# Altium project 20211127_mach duoi NCKH.PrjPcb
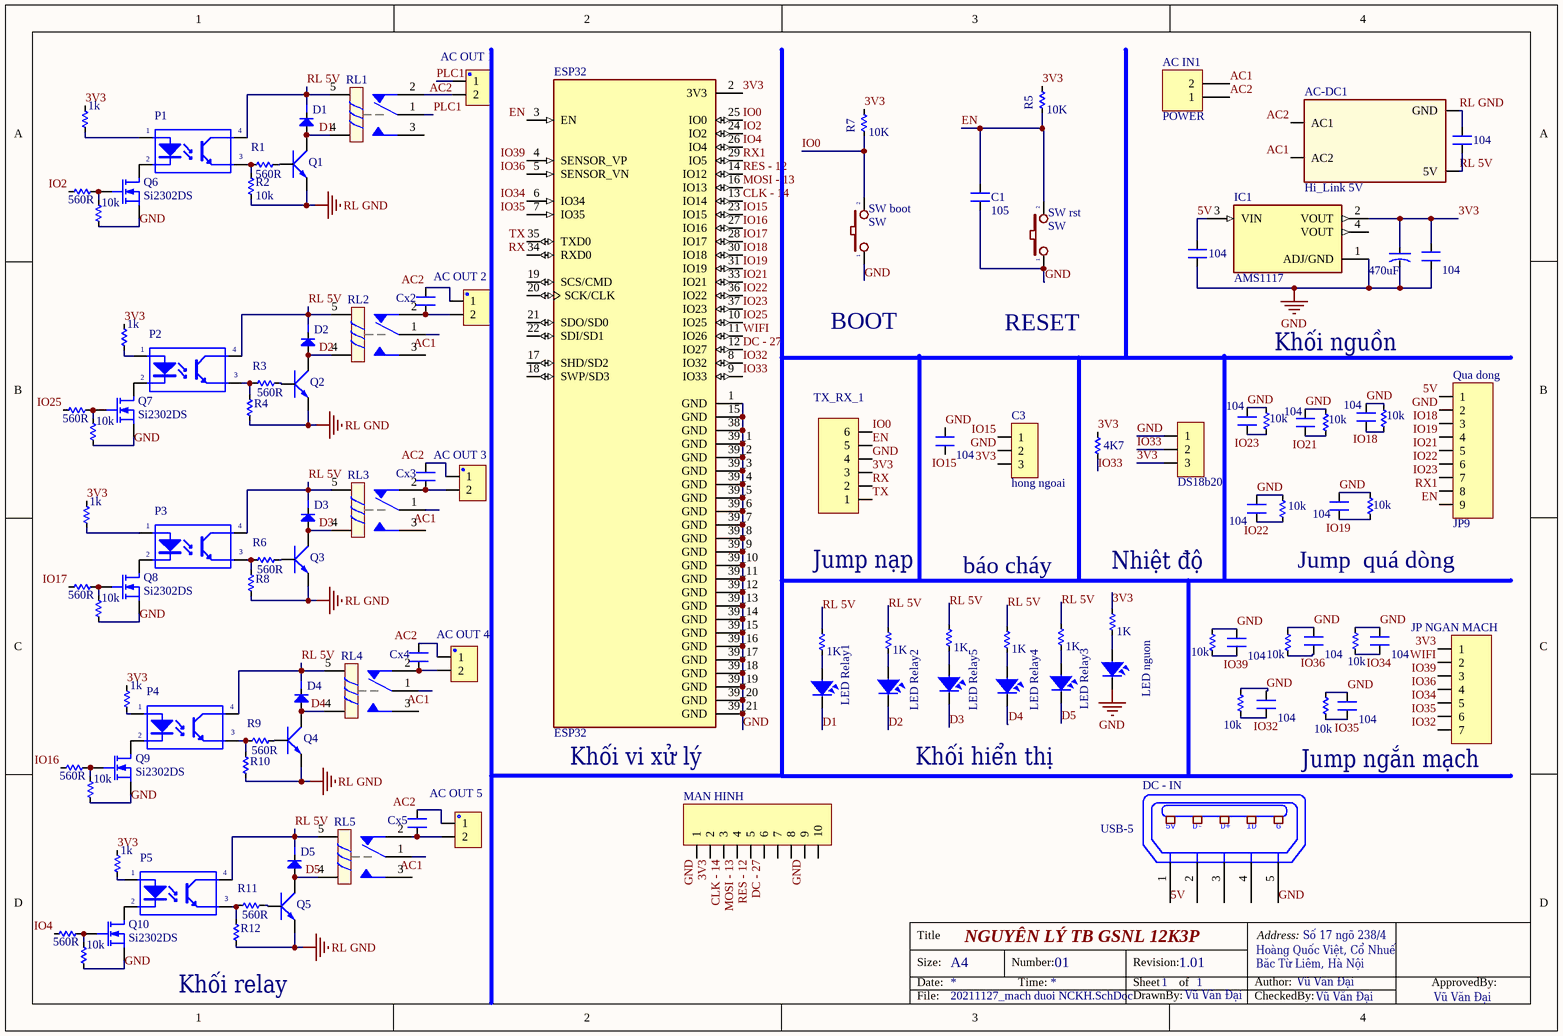
[diagram p0: 20211127_mach duoi NCKH.SchDoc]
1 sheet, 113 parts. Net scope: global (net labels, ports and power ports of the same name join across sheets).
Board files: 20211127_mach duoi NCKH.PcbDoc, in.PcbDoc

## Sheet 20211127_mach duoi NCKH.SchDoc: NGUYÊN LÝ TB GSNL 12K3P
size A4; ENG_APP_DATE: --/--/--; DSN_APP_DATE: --/--/--; CHK_APP_DATE: --/--/--; Date: T3; ApprovedBy: Vũ Văn Đại; CheckedBy: Vũ Văn Đại; Author: Vũ Văn Đại; DrawnBy: Vũ Văn Đại; Engineer: KS Vu Van Dại; Organization: IOTeamVN; Address1: Số 17 ngõ 238/4; Address2: Hoàng Quốc Việt, Cổ Nhuế; Address3: Băc Từ Liêm, Hà Nội; Address4: -; DocumentNumber: 01; Revision: 1.01; SheetNumber: 1; SheetTotal: 1; Time: 06:00

### Parts
1  1k  [RES-SMD-0805]
2  1k  [RES-SMD-0805]
3  1k  [RES-SMD-0805]
4  1K  [RES-SMD-0805]
5  10k  [RES-SMD-0805]
6  1k  [RES-SMD-0805]
7  1k  [RES-SMD-0805]
8  1K  [RES-SMD-0805]
9  1K  [RES-SMD-0805]
10  1K  [RES-SMD-0805]
11  1K  [RES-SMD-0805]
12  1K  [RES-SMD-0805]
13  10k  [RES-SMD-0805]
14  10k  [RES-SMD-0805]
15  10k  [RES-SMD-0805]
16  10k  [RES-SMD-0805]
17  560R  [RES-SMD-0805]
18  10k  [RES-SMD-0805]
19  560R  [RES-SMD-0805]
20  10k  [RES-SMD-0805]
21  560R  [RES-SMD-0805]
22  10k  [RES-SMD-0805]
23  560R  [RES-SMD-0805]
24  10k  [RES-SMD-0805]
25  560R  [RES-SMD-0805]
26  10k  [RES-SMD-0805]
27  10k  [RES-SMD-0805]
28  10k  [RES-SMD-0805]
29  10k  [RES-SMD-0805]
30  10k  [RES-SMD-0805]
31  10k  [RES-SMD-0805]
AC-DC1  Hi_Link 5V  [HI LINK 3.3V5W, 5V5W]
AC_IN1  POWER  [HED2]
AC_OUT_1  Header2  [con 2 p xanh la]  (value not drawn)
AC_OUT_2  Header2  [con 2 p xanh la]  (value not drawn)
AC_OUT_3  Header2  [con 2 p xanh la]  (value not drawn)
AC_OUT_4  Header2  [con 2 p xanh la]  (value not drawn)
AC_OUT_5  Header2  [con 2 p xanh la]  (value not drawn)
C1  105  [CN-SMD-0805]
C3  hong ngoai  [JP3-D1C]
CAP_1  470uF  [CA-ALU-6.3R]
cc1  104  [CN-SMD-0805]
cc2  104  [CN-SMD-0805]
cc3  104  [CN-SMD-0805]
cc4  104  [CN-SMD-0805]
cc5  104  [CN-SMD-0805]
cc6  104  [CN-SMD-0805]
cc7  104  [CN-SMD-0805]
cc8  104  [CN-SMD-0805]
cc9  104  [CN-SMD-0805]
cc10  104  [CN-SMD-0805]
cc11  104  [CN-SMD-0805]
cc12  104  [CN-SMD-0805]
cc13  104  [CN-SMD-0805]
cc14  104  [CN-SMD-0805]
Cx2  XXpF  [CN2-O]  (value not drawn)
Cx3  XXpF  [CN2-O]  (value not drawn)
Cx4  XXpF  [CN2-O]  (value not drawn)
Cx5  XXpF  [CN2-O]  (value not drawn)
D1  Diode  [DIO-1A]  (value not drawn)
D2  Diode  [DIO-1A]  (value not drawn)
D3  Diode  [DIO-1A]  (value not drawn)
D4  Diode  [DIO-1A]  (value not drawn)
D5  Diode  [DIO-1A]  (value not drawn)
DC_-_IN  USB-5  [USB-M1]
DS1  DS18b20  [JP3-D1C]
ESP32  ESP32  [ESP32]
IC1  AMS1117  [Ams1117]
JP_NGAN_MACH  JP7  [JP7-D1C]  (value not drawn)
LED_nguon  LED  [LED-0805-Blue]  (value not drawn)
LED_Relay1  LED  [LED-0805-Red]  (value not drawn)
LED_Relay2  LED  [LED-0805-Red]  (value not drawn)
LED_Relay3  LED  [LED-0805-Red]  (value not drawn)
LED_Relay4  LED  [LED-0805-Red]  (value not drawn)
LED_Relay5  LED  [LED-0805-Red]  (value not drawn)
MAN_HINH  JP10  [JP10-D1C]  (value not drawn)
P1  PC817  [DIP4]  (value not drawn)
P2  PC817  [DIP4]  (value not drawn)
P3  PC817  [DIP4]  (value not drawn)
P4  PC817  [DIP4]  (value not drawn)
P5  PC817  [DIP4]  (value not drawn)
Q1  C1815  [TO92-123 - 3]  (value not drawn)
Q2  C1815  [TO92-123 - 3]  (value not drawn)
Q3  C1815  [TO92-123 - 3]  (value not drawn)
Q4  C1815  [TO92-123 - 3]  (value not drawn)
Q5  C1815  [TO92-123 - 3]  (value not drawn)
Q6  Si2302DS  [SOT23-132]
Q7  Si2302DS  [SOT23-132]
Q8  Si2302DS  [SOT23-132]
Q9  Si2302DS  [SOT23-132]
Q10  Si2302DS  [SOT23-132]
Qua_dong  JP9  [JP9-D1C]
R1  560R  [RES-SMD-0805]
R2  10k  [RES-SMD-0805]
R3  560R  [RES-SMD-0805]
R4  10k  [RES-SMD-0805]  (value not drawn)
R5  10K  [RES-SMD-0805]
R6  560R  [RES-SMD-0805]
R7  10K  [RES-SMD-0805]
R8  10k  [RES-SMD-0805]  (value not drawn)
R9  560R  [RES-SMD-0805]
R10  10k  [RES-SMD-0805]  (value not drawn)
R11  560R  [RES-SMD-0805]
R12  10k  [RES-SMD-0805]  (value not drawn)
R13  4K7  [RES-SMD-0805]
RL1  Relay 10A/5V  [RELAY 5]  (value not drawn)
RL2  Relay 10A/5V  [RELAY 5]  (value not drawn)
RL3  Relay 10A/5V  [RELAY 5]  (value not drawn)
RL4  Relay 10A/5V  [RELAY 5]  (value not drawn)
RL5  Relay 10A/5V  [RELAY 5]  (value not drawn)
SW_boot  SW  [SW1-DIP]
SW_rst  SW  [SW1-DIP]
TX_RX_1  JP6  [JP6-D1T]  (value not drawn)

### Nets
GND: 5.2 13.2 14.2 15.2 16.2 18.2 20.2 22.2 24.2 26.2 27.2 28.2 29.2 30.2 31.2 C1.1 C3.2 CAP_1.2 cc1.1 cc2.1 cc3.1 cc4.1 cc5.1 cc6.1 cc7.1 cc8.1 cc9.1 cc10.1 cc11.1 cc12.1 cc13.1 DC_-_IN.5(P5) DS1.1 ESP32.1(GND) ESP32.15(GND) ESP32.38(GND) ESP32.39_1(GND) ESP32.39_2(GND) ESP32.39_3(GND) ESP32.39_4(GND) ESP32.39_5(GND) ESP32.39_6(GND) ESP32.39_7(GND) ESP32.39_8(GND) ESP32.39_9(GND) ESP32.39_10(GND) ESP32.39_11(GND) ESP32.39_12(GND) ESP32.39_13(GND) ESP32.39_14(GND) ESP32.39_15(GND) ESP32.39_16(GND) ESP32.39_17(GND) ESP32.39_18(GND) ESP32.39_19(GND) ESP32.39_20(GND) ESP32.39_21(GND) IC1.1(ADJ/GND) LED_nguon.2 MAN_HINH.1 MAN_HINH.9 Q6.2(S) Q7.2(S) Q8.2(S) Q9.2(S) Q10.2(S) Qua_dong.2 SW_boot.1 SW_rst.1 TX_RX_1.4
RL GND: AC-DC1.4(GND) cc14.2 Q1.1(E) Q2.1(E) Q3.1(E) Q4.1(E) Q5.1(E) R2.2 R4.2 R8.2 R10.2 R12.2
3V3: 1.2 2.2 3.2 4.2 6.2 7.2 C3.3 CAP_1.1 cc2.2 DS1.3 ESP32.2(3V3) IC1.2(VOUT) JP_NGAN_MACH.1 MAN_HINH.2 R5.2 R7.2 R13.2 TX_RX_1.3
5V: cc1.2 DC_-_IN.1(P1) IC1.3(VIN) Qua_dong.1
AC1: AC-DC1.2(AC2) AC_IN1.2 RL2.1 RL3.1 RL4.1 RL5.1
AC2: AC-DC1.1(AC1) AC_IN1.1 AC_OUT_2.1 AC_OUT_3.1 AC_OUT_4.1 AC_OUT_5.1 Cx2.2 Cx3.2 Cx4.2 Cx5.2
CLK - 14: ESP32.13(IO14) MAN_HINH.3
D1: D1.1(A) LED_Relay1.2 Q1.2(C) RL1.4
D2: D2.1(A) LED_Relay2.2 Q2.2(C) RL2.4
D3: D3.1(A) LED_Relay5.2 Q3.2(C) RL3.4
D4: D4.1(A) LED_Relay4.2 Q4.2(C) RL4.4
D5: D5.1(A) LED_Relay3.2 Q5.2(C) RL5.4
DC - 27: ESP32.12(IO27) MAN_HINH.6
EN: C1.2 ESP32.3(EN) Qua_dong.9 R5.1 SW_rst.2 TX_RX_1.5
IO0: ESP32.25(IO0) R7.1 SW_boot.2 TX_RX_1.6
IO2: 17.2 ESP32.24(IO2)
IO4: 25.2 ESP32.26(IO4)
IO15: C3.1 cc13.2 ESP32.23(IO15)
IO16: 23.2 ESP32.27(IO16)
IO17: 21.2 ESP32.28(IO17)
IO18: 27.1 cc8.2 ESP32.30(IO18) Qua_dong.3
IO19: 30.1 cc9.2 ESP32.31(IO19) Qua_dong.4
IO21: 29.1 cc10.2 ESP32.33(IO21) Qua_dong.5
IO22: 31.1 cc11.2 ESP32.36(IO22) Qua_dong.6
IO23: 28.1 cc12.2 ESP32.37(IO23) Qua_dong.7
IO25: 19.2 ESP32.10(IO25)
IO32: 15.1 cc5.2 ESP32.8(IO32) JP_NGAN_MACH.7
IO33: DS1.2 ESP32.9(IO33) R13.1
IO34: 13.1 cc4.2 ESP32.6(IO34) JP_NGAN_MACH.5
IO35: 16.1 cc6.2 ESP32.7(IO35) JP_NGAN_MACH.6
IO36: 14.1 cc7.2 ESP32.5(SENSOR_VN) JP_NGAN_MACH.4
IO39: 5.1 cc3.2 ESP32.4(SENSOR_VP) JP_NGAN_MACH.3
MOSI - 13: ESP32.16(IO13) MAN_HINH.4
PLC1: AC_OUT_1.1 RL1.1
RES - 12: ESP32.14(IO12) MAN_HINH.5
RL 5V: 8.2 9.2 10.2 11.2 12.2 AC-DC1.3(5V) cc14.1 D1.2(K) D2.2(K) D3.2(K) D4.2(K) D5.2(K) P1.4(C) P2.4(C) P3.4(C) P4.4(C) P5.4(C) RL1.5 RL2.5 RL3.5 RL4.5 RL5.5
RX: ESP32.34(RXD0) TX_RX_1.2
RX1: ESP32.29(IO5) Qua_dong.8
TX: ESP32.35(TXD0) TX_RX_1.1
WIFI: ESP32.11(IO26) JP_NGAN_MACH.2
Net1_1: 1.1 P1.1(A)
Net2_1: 2.1 P2.1(A)
Net3_1: 3.1 P3.1(A)
Net4_1: 4.1 LED_nguon.1
Net6_1: 6.1 P4.1(A)
Net7_1: 7.1 P5.1(A)
Net8_1: 8.1 LED_Relay1.1
Net9_1: 9.1 LED_Relay2.1
Net10_1: 10.1 LED_Relay3.1
Net11_1: 11.1 LED_Relay4.1
Net12_1: 12.1 LED_Relay5.1
Net17_1: 17.1 18.1 Q6.1(G)
Net19_1: 19.1 20.1 Q7.1(G)
Net21_1: 21.1 22.1 Q8.1(G)
Net23_1: 23.1 24.1 Q9.1(G)
Net25_1: 25.1 26.1 Q10.1(G)
NetAC_OUT_1_2: AC_OUT_1.2 RL1.2
NetAC_OUT_2_2: AC_OUT_2.2 Cx2.1 RL2.2
NetAC_OUT_3_2: AC_OUT_3.2 Cx3.1 RL3.2
NetAC_OUT_4_2: AC_OUT_4.2 Cx4.1 RL4.2
NetAC_OUT_5_2: AC_OUT_5.2 Cx5.1 RL5.2
NetP1_2: P1.2(K) Q6.3(D)
NetP1_3: P1.3(E) R1.1 R2.1
NetP2_2: P2.2(K) Q7.3(D)
NetP2_3: P2.3(E) R3.1 R4.1
NetP3_2: P3.2(K) Q8.3(D)
NetP3_3: P3.3(E) R6.1 R8.1
NetP4_2: P4.2(K) Q9.3(D)
NetP4_3: P4.3(E) R9.1 R10.1
NetP5_2: P5.2(K) Q10.3(D)
NetP5_3: P5.3(E) R11.1 R12.1
NetQ1_3: Q1.3(B) R1.2
NetQ2_3: Q2.3(B) R3.2
NetQ3_3: Q3.3(B) R6.2
NetQ4_3: Q4.3(B) R9.2
NetQ5_3: Q5.3(B) R11.2

Not connected (* = marked no-connect by the designer): DC_-_IN 2(P2) 3(P3) 4(P4); ESP32 17(SHD/SD2) 18(SWP/SD3) 19(SCS/CMD) 20(SCK/CLK) 21(SDO/SD0) 22(SDI/SD1); IC1 4(VOUT); MAN_HINH 7 8 10; RL1 3; RL2 3; RL3 3; RL4 3; RL5 3

### Notes on the sheet
- BOOT
- RESET
- Khối nguồn
- Jump nạp
- báo cháy
- Nhiệt độ
- Jump  quá dòng
- (near ESP32) Khối vi xử lý
- Khối hiển thị
- (near JP_NGAN_MACH) Jump ngắn mạch
- (near R12) Khối relay
- Labels drawn without touching a wire or pin: AC2
- Title
- Size:
- Date:
- A4
- Number:
- Time:
- Revision:
- Sheet
- of
- Author:
- Address:
- ApprovedBy:
- File:
- DrawnBy:
- CheckedBy:
- (in symbol USB-5) 5V; D-; D+; ID; G

### Library data of the parts
1-31 R1-R13 = Res: Manufacturer: Generic Components; Class: Passive; SubClass: R; Published: 08/06/2000; Publisher: Altium Hobart Technology Centre
AC_IN1 = Header 2_1: Header, 2-Pin; Manufacturer: Generic Components; Class: Connector; Value: Header 2
AC_OUT_1-AC_OUT_5 = Con 2P: Header IDC, 2 x 1 Pin Vertical 2.54mm Pitch (Non-Boxed, Male); Manufacturer: W¨¹rth Elektronik eiSos GmbH; partNo: 613002143121; ComponentLink1 Description: Manufacturer; ComponentLink2 Description: Datasheet; NoPins: 02; Created Date: 29 March 2013; ComponentLink1URL: http://www.we-online.com; ComponentLink2URL: http://katalog.we-online.de/em/datasheet/6130xx143121.pdf; Created by: Karrer Zheng
C1 = CN1: Cap np  1pF - 472pF; Value: 100pF
C3 DS1 = JP3: WR-PHD 2.54 mm Angled Socket Header; Manufacturer: W¨¹rth Elektronik eiSos GmbH; partNo: 613003143121; ComponentLink1 Description: Manufacturer; ComponentLink2 Description: Datasheet; NoPins: 03; Created Date: 29 March 2013; ComponentLink1URL: http://www.we-online.com; ComponentLink2URL: http://katalog.we-online.de/em/datasheet/6130xx143121.pdf; Created by: Karrer Zheng
CAP_1 = CN-ALU-DIP: Capacitor (Semiconductor SIM Model); Value: 104; LatestRevisionDate: 17-Jul-2002; LatestRevisionNote: Re-released for DXP Platform.; PackageReference: C1206; Publisher: Altium Limited
cc1-cc14 Cx2-Cx5 = CN: Value: 33pF
D1-D5 = Diode: Default Diode; Code - JEDEC: DO-214-AB; Value: 1N5007; Published: 8-Jun-2000; Revision: July-2002: Re-released for DXP Platform.; Publisher: Altium Limited
DC_-_IN = USB-5: Manufacturer: FCI; Manufacturer Part Number: 10118193-0001LF; Connector Type: USB - micro B; Number of Contacts: 5; Gender: Receptacle; Specifications: USB 2.0; .Creator: MM; .Checked PCB: RF; Supplier 1: Digi-Key; RoHS: RoHS Compliant; Category: Connectors, Interconnects; Stock 1: 28642; Pricing 1: 1=0.46, 10=0.433, 25=0.3712, 50=0.3156, 100=0.3032, 250=0.27224, 500=0.25988 (USD); Packaging: Cut Tape (CT); Mounting Type: Surface Mount, Right Angle, Horizontal; Features: Shielded, Solder Retention; Ingress Protection: -; ComponentLink1URL: http://portal.fciconnect.com/Comergent//fci/drawing/10118193.pdf; ComponentLink1Description: http://portal.fciconnect.com/Comergent//fci/drawing/10118193.pdf; Supplier Part Number 1: 609-4616-1-ND; .Checked SCH: MM
JP_NGAN_MACH = JP7: WR-PHD 2.54 mm Angled Socket Header; Manufacturer: W¨¹rth Elektronik eiSos GmbH; partNo: 613007143121; ComponentLink1 Description: Manufacturer; ComponentLink2 Description: Datasheet; NoPins: 07; Created Date: 29 March 2013; ComponentLink1URL: http://www.we-online.com; ComponentLink2URL: http://katalog.we-online.de/em/datasheet/6130xx143121.pdf; Created by: Karrer Zheng
LED_nguon LED_Relay1-LED_Relay5 = LED SMD: Value: LED 3 - 5 ly 2 Colour
MAN_HINH = JP10: WR-PHD 2.54 mm Angled Socket Header; Manufacturer: W¨¹rth Elektronik eiSos GmbH; partNo: 613010143121; ComponentLink1 Description: Manufacturer; ComponentLink2 Description: Datasheet; NoPins: 10; Created Date: 29 March 2013; ComponentLink1URL: http://www.we-online.com; ComponentLink2URL: http://katalog.we-online.de/em/datasheet/6130xx143121.pdf; Created by: Karrer Zheng
P1-P5 = PC817: Single Opto; Value: PC817
Q1-Q5 = C1815: NPN 600mW, ECB; Value: C1815
Q6-Q10 = Si2302DS: N-Channel MOSFET; Published: 8-Jun-2000; LatestRevisionDate: 17-Jul-2002; LatestRevisionNote: Re-released for DXP Platform.; PackageVersion: 1995/1996; PackageReference: E3; Publisher: Altium Limited; PackageDescription: TO, Flat Index; 3 In-Line, Axial Leads; Body Dia. 4.6mm; Lead Dia. 0.5 mm (max)
Qua_dong = JP9: WR-PHD 2.54 mm Angled Socket Header; Manufacturer: W¨¹rth Elektronik eiSos GmbH; partNo: 613009143121; ComponentLink1 Description: Manufacturer; ComponentLink2 Description: Datasheet; NoPins: 09; Created Date: 29 March 2013; ComponentLink1URL: http://www.we-online.com; ComponentLink2URL: http://katalog.we-online.de/em/datasheet/6130xx143121.pdf; Created by: Karrer Zheng
RL1-RL5 = Relay 5: Relay SPDT,10A - 12VDC 5 Pin; Value: Relay SPDT, 10A, 12V
SW_boot SW_rst = SW2: Switch button 2 pin; Value: SW chip 2 pin
TX_RX_1 = JP6: WR-PHD 2.54 mm Angled Socket Header; Manufacturer: W¨¹rth Elektronik eiSos GmbH; partNo: 613006143121; ComponentLink1 Description: Manufacturer; ComponentLink2 Description: Datasheet; NoPins: 06; Created Date: 29 March 2013; ComponentLink1URL: http://www.we-online.com; ComponentLink2URL: http://katalog.we-online.de/em/datasheet/6130xx143121.pdf; Created by: Karrer Zheng